# EAGLE design FT-991A_PAT (EAGLE 9.3.0)
COPYRIGHT: PY2RAF; DOCUMENT_ID: PAT-991A; PROJECT_INFO: Yaesu FT-991A Panadapter with Signal Control; PROJECT_NAME: FT-991A PAT & SDR; REVISAO: F; REVISION_ID: F
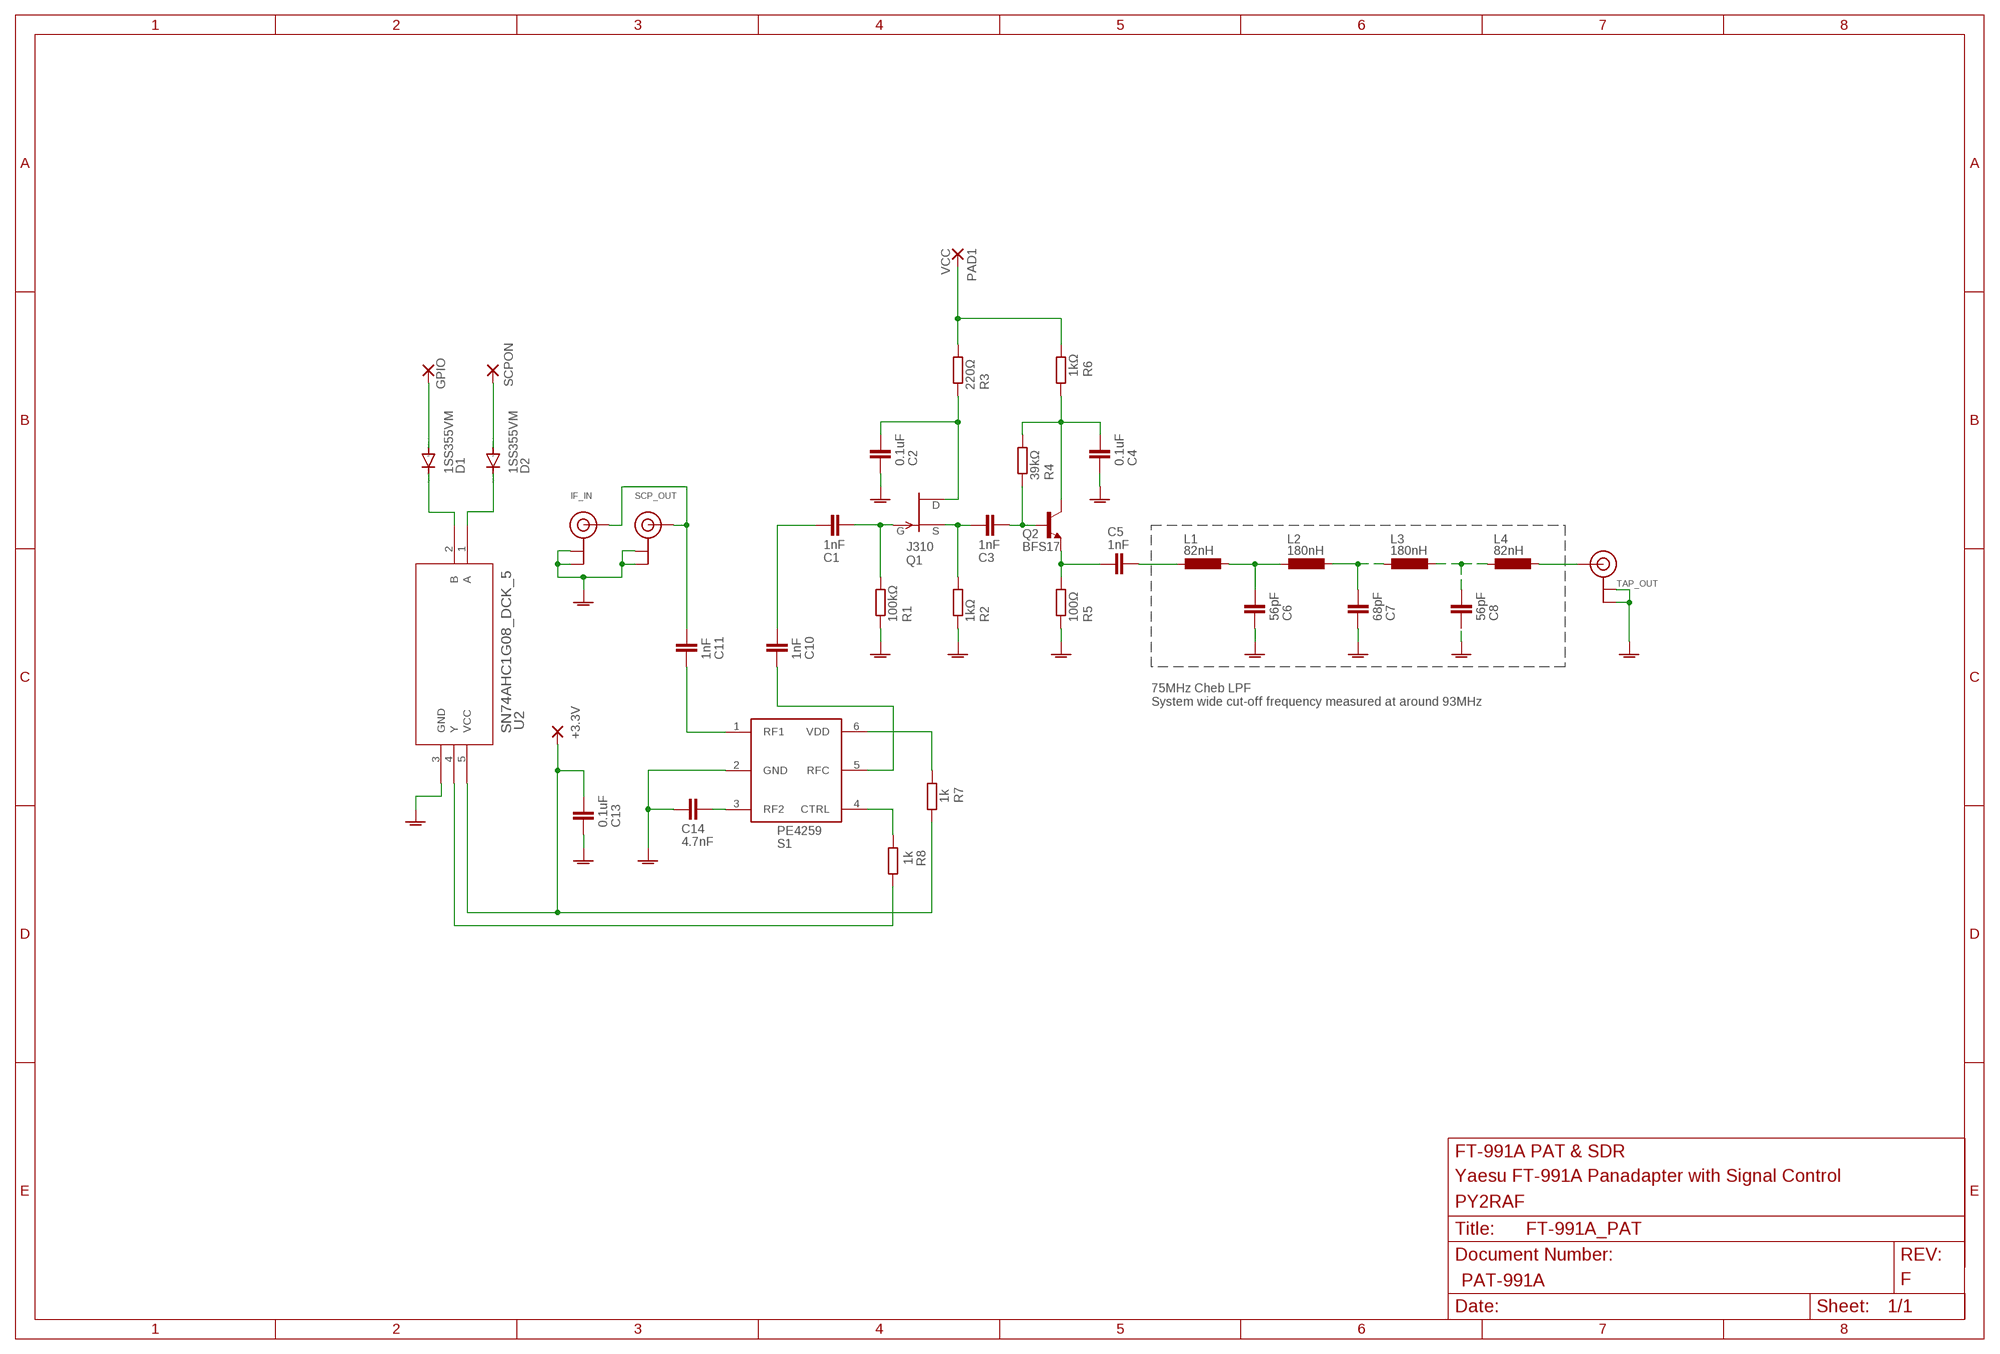
[diagram p0: schematic, sheet 1]

## Parts
+3.3V  WIREPADSMD1,27-254  [SMD1,27-2,54]
C1  1nF  C-EUC0805K  [C0805K]
C2  0.1uF  C-EUC0805K  [C0805K]
C3  1nF  C-EUC0805K  [C0805K]
C4  0.1uF  C-EUC0805K  [C0805K]
C5  1nF  C-EUC0805K  [C0805K]
C6  56pF  C-EUC0805K  [C0805K]
C7  68pF  C-EUC0805K  [C0805K]
C8  56pF  C-EUC0805K  [C0805K]
C10  1nF  C-EUC0805K  [C0805K]
C11  1nF  C-EUC0805K  [C0805K]
C13  0.1uF  C-EUC0805K  [C0805K]
C14  4.7nF  C-EUC0805K  [C0805K]
D1  1SS355VM  DIODE-SOD323-W  [SOD323-W]
D2  1SS355VM  DIODE-SOD323-W  [SOD323-W]
GPIO  GPIO  WIREPADSMD1,27-254  [SMD1,27-2,54]
L1  82nH  L-EU  [L0805]
L2  180nH  L-EU  [L0805]
L3  180nH  L-EU  [L0805]
L4  82nH  L-EU  [L0805]
PAD1  VCC  WIREPADSMD2,54-5,08  [SMD2,54-5,08]
Q1  J310  SST201  [SOT23]
Q2  BFS17  BC846  [SOT23]
R1  100kΩ  R-EU_R0805  [R0805]
R2  1kΩ  R-EU_R0805  [R0805]
R3  220Ω  R-EU_R0805  [R0805]
R4  39kΩ  R-EU_R0805  [R0805]
R5  100Ω  R-EU_R0805  [R0805]
R6  1kΩ  R-EU_R1206  [R1206]
R7  1k  R-EU_R0805  [R0805]
R8  1k  R-EU_R0805  [R0805]
S1  PE4259  [SC-70]
SCPON  SCPON  WIREPADSMD1,27-254  [SMD1,27-2,54]
TAP_OUT  TAP_OUT  ANTENNA_U.FL  [U.FL]
U2  SN74AHC1G08_DCK_5  [DCK5]
X1  SCP_OUT  ANTENNA_U.FL  [U.FL]
X2  IF_IN  ANTENNA_U.FL  [U.FL]

## Nets
GNDA: C2.2 C4.2 C6.2 C7.2 C8.2 C13.2 C14.1 R1.1 R2.1 R5.2 S1.2(GND) TAP_OUT.1(GND) TAP_OUT.2(GND) U2.3(GND) X1.1(GND) X1.2(GND) X2.1(GND) X2.2(GND)
N$1: C5.1 Q2.2(E) R5.1
N$2: C5.2 L1.1
N$3: C6.1 L1.2 L2.1
N$4: C3.2 Q2.1(B) R4.2
N$5: C3.1 Q1.2(S) R2.2
N$6: C1.2 Q1.3(G) R1.2
N$7: C11.1 X1.3(SIGNAL) X2.3(SIGNAL)
N$8: PAD1.1(P) R3.2 R6.1
N$9: C2.1 Q1.1(D) R3.1
N$10: C4.1 Q2.3(C) R4.1 R6.2
N$11: C7.1 L2.2 L3.1
N$12: L4.2 TAP_OUT.3(SIGNAL)
N$13: C8.1 L3.2 L4.1
N$14: C1.1 C10.1
N$15: C10.2 S1.5(RFC)
N$16: D1.A GPIO.1(P)
N$17: D1.C U2.2(B)
N$18: D2.A SCPON.1(P)
N$19: R8.2 S1.4(CTRL)
N$20: D2.C U2.1(A)
N$21: C11.2 S1.1(RF1)
N$22: R8.1 U2.4(Y)
N$24: C14.2 S1.3(RF2)
VCC: +3.3V.1(P) C13.1 R7.1 U2.5(VCC)
VDD: R7.2 S1.6(VDD)

## Notes on the sheet
- 75MHz Cheb LPF
  System wide cut-off frequency measured at around 93MHz

## Library data of the parts
+3.3V GPIO PAD1 SCPON = wirepad:WIREPAD: Wire PAD connect wire on PCB
C1-C8 C10 C11 C13 C14 = rcl:C-EU: CAPACITOR, European symbol
D1 D2 = diode:DIODE-: DIODE
L1-L4 = rcl-modified:L-EU: INDUCTOR, European symbol
Q1 = transistor-fet:?20*: TEMIC / Siliconix N-Channel JFET Source: JFET-J201_Siliconix_data.pdf; SPICEPREFIX: J
Q2 = transistor:BC846: NPN TRANSISTOR
R1-R8 = rcl:R-EU_: RESISTOR, European symbol
S1 = psemi:PE4259: PE4259 SPDT High Power UltraCMOS 10 MHz 3.0 GHz RF Switch Features - High ESD tolerance of 2 kV HBM - Single-pin or complementary CMOS logic control inputs - Low insertion loss: * 0.35 dB @ 1000 MHz * 0.5 dB @ 2000 MHz - Isolation of 30 dB @ 1000 MHz - Typical input 1 dB compression point of +33.5 dBm - 1.8V minimum power supply voltage - Ultra-small SC-70 package
TAP_OUT X1 X2 = adafruit:ANTENNA_U.FL: U.FL Antenna Connector
U2 = sn74ahc1g08-dck:SN74AHC1G08_DCK_5; DATASHEETURL: httpwww.ti.comlitgpnSN74AHC1G08; FAMILY_NAME: LL AND GATE; GENERIC_PART_NUMBER: SN74AHC1G08; INDUSTRY_STD_PKG_TYPE: SC70; MANUFACTURER: Texas Instruments; MANUFACTURER_PART_NUMBER: sn74ahc1g08_dck_5; PACKAGE_DESIGNATOR: DCK; PIN_COUNT: 5; VENDOR: Texas Instruments

## Board
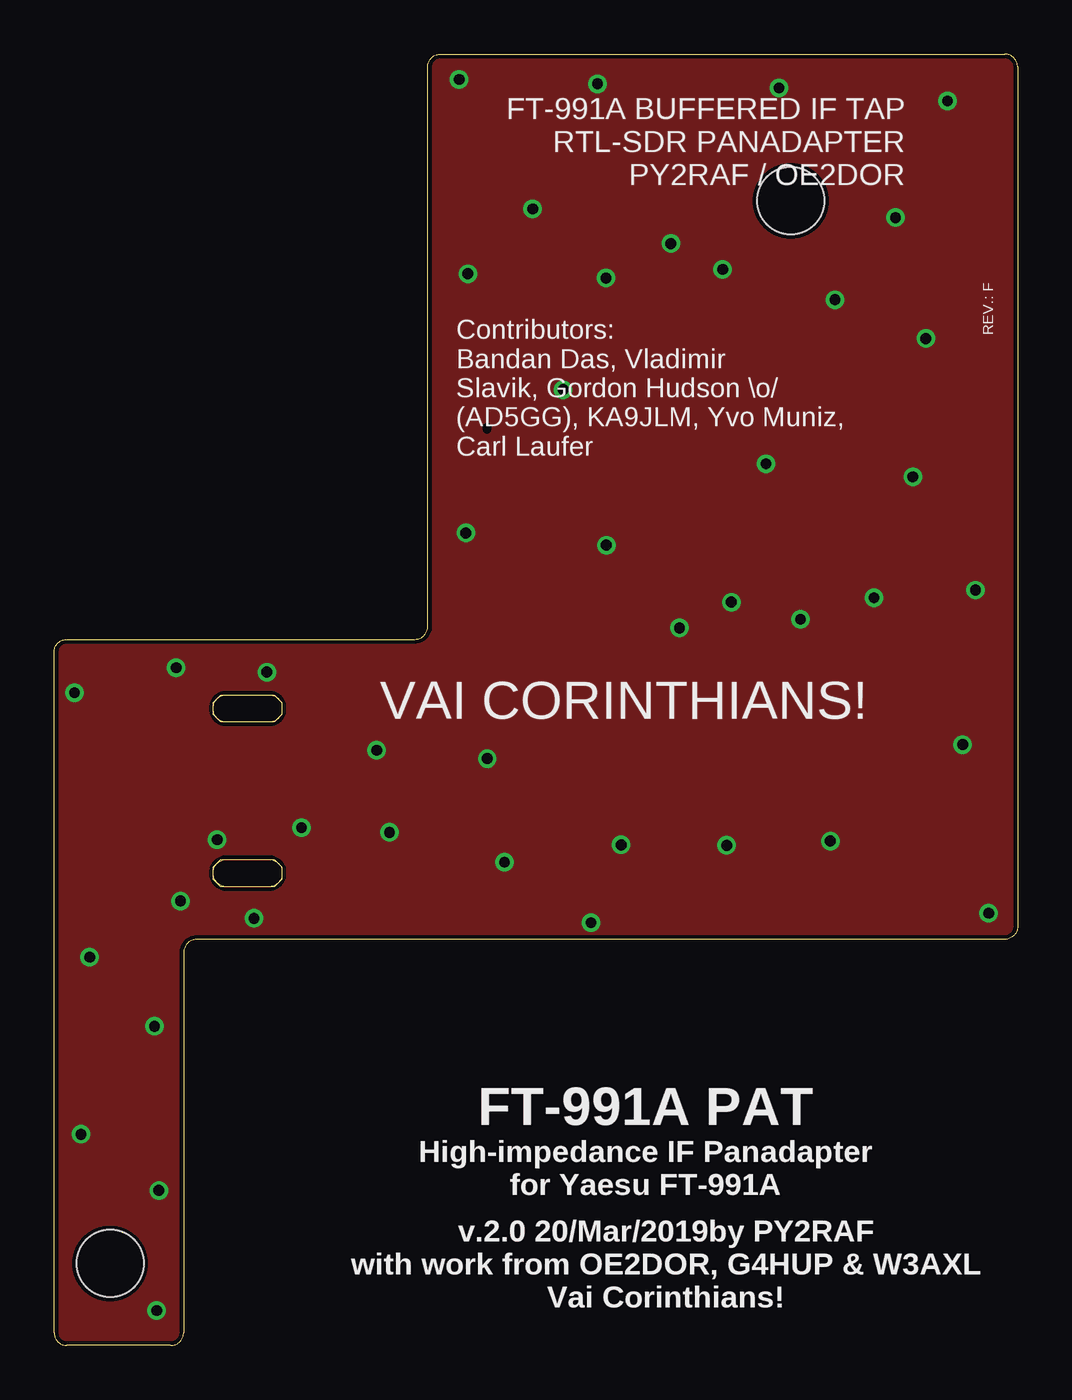
[diagram p1: board, top side]
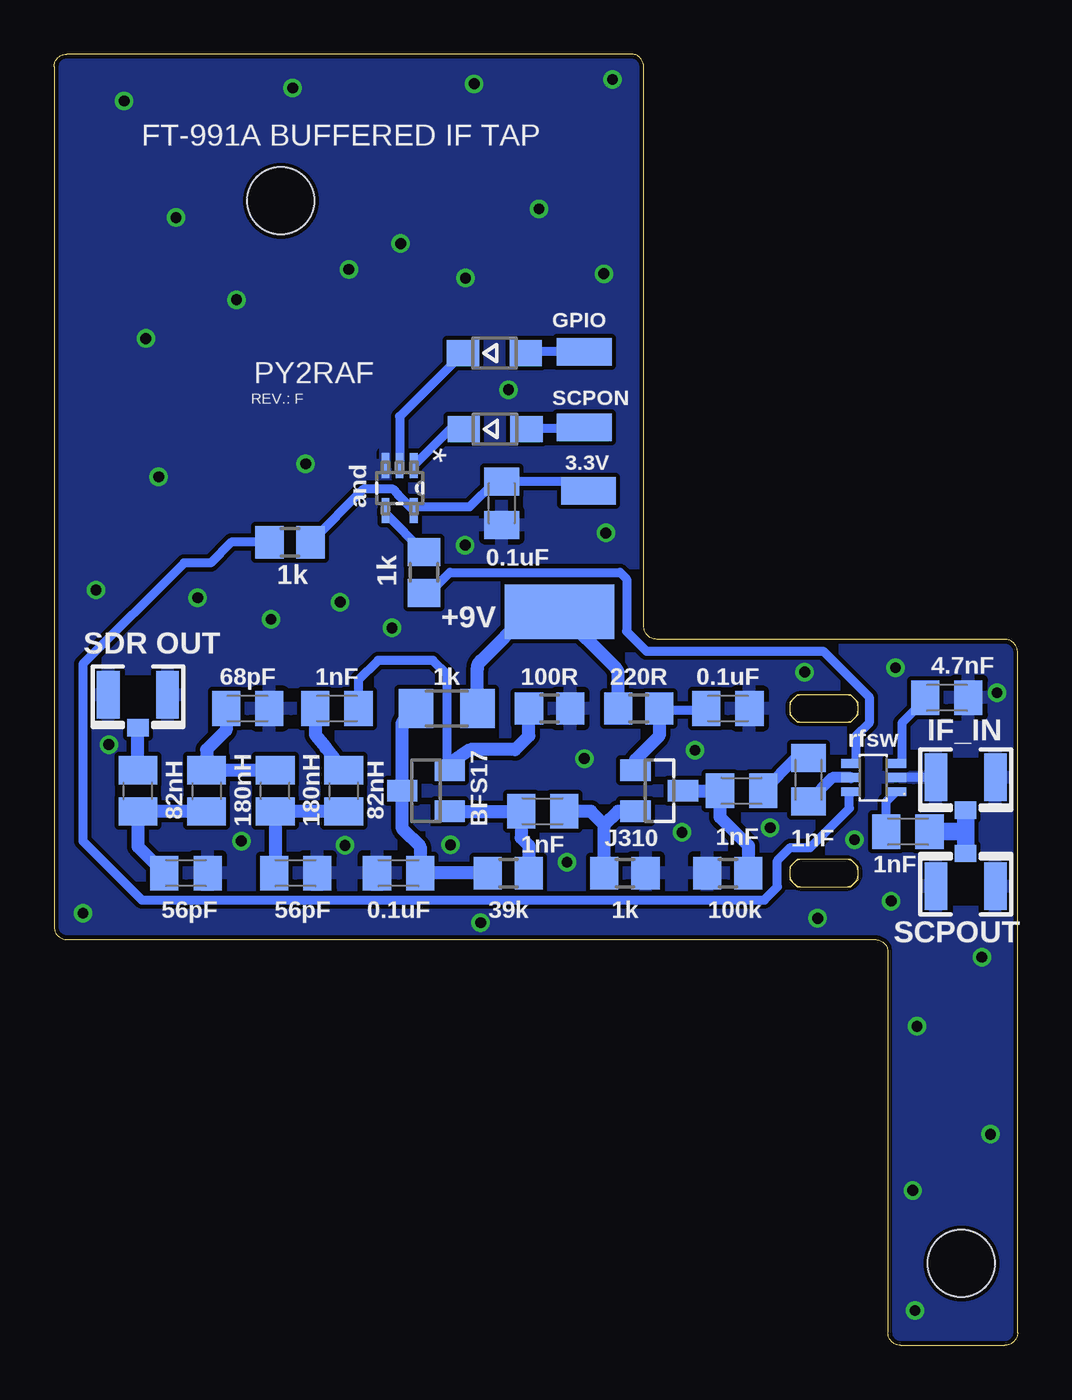
[diagram p2: board, bottom side, seen from below]

Size 44.6 x 59.8 mm. Coordinates in mm from the lower left corner, seen from the top.
Outline: 0,0.6 0,32.1 arc-90 0.6,32.7 16.7,32.7 arc90 17.3,33.3 17.3,59.2 arc-90 17.9,59.8 44,59.8 arc-90 44.6,59.2 44.6,19.4 arc-90 44,18.8 6.6,18.8 arc90 6,18.2 6,0.6 arc-90 5.4,0 0.6,0 arc-90 0,0.6
Outline: 9.95,28.86 7.98,28.86 arc-90 7.38,29.46 7.38,29.53 arc-90 7.98,30.13 9.95,30.13 arc-90 10.55,29.53 10.55,29.46 arc-90 9.95,28.86
Outline: 7.98,22.51 9.95,22.51 arc-90 10.55,21.91 10.55,21.84 arc-90 9.95,21.24 7.98,21.24 arc-90 7.38,21.84 7.38,21.91 arc-90 7.98,22.51
Copper layers (1*16): Top 0.0356mm / dielectric 1.6mm / Bottom 0.0356mm
Design rules "LaenPCBOrder *": minimum track width 16mil, minimum drill 0.5mm, track to track 0.2mm, track to pad 0.2mm, pad to pad 0.2mm, via to via 0.2mm, smd to smd 0.2mm, copper to edge 0.2mm, drill to drill 0.2mm, minimum pad ring 7mil, minimum via ring 7mil, stop-mask expansion 3mil, vias tented up to drill 0mil, thermal gap 10mil
Holes 3.1 mm at 34.1,53 2.6,3.8
Milling: 16 lines

### Footprints (pad centres in the part's own frame; a part is rotated, then mirrored left to right if it is on the bottom)
SMD1,27-2,54 = smd 1.27 x 2.54: 1 0,0
C0805K = smd 1.3 x 1.6: 1 -1,0; 2 1,0
SOD323-W = smd 1.5 x 1.2: A 1.45,0; C -1.45,0
L0805 = smd 1.3 x 1.8: 1 -0.95,0; 2 0.95,0
SMD2,54-5,08 = smd 2.54 x 5.08: 1 0,0
SOT23 = smd 1 x 1.4: 1 -0.95,-1.1; 2 0.95,-1.1; 3 0,1.1
R0805 = smd 1.3 x 1.5: 1 -0.95,0; 2 0.95,0
R1206 = smd 1.6 x 1.803: 1 -1.422,0; 2 1.422,0
SC-70 = smd 0.4 x 0.9: 1 -0.635,-1.035; 2 0.015,-1.035; 3 0.665,-1.035; 4 0.665,1.065; 5 0.015,1.065; 6 -0.635,1.065
U.FL = smd 2.2 x 1.05: 1 0,1.375; 2 0,-1.375 | smd 0.8 x 1: 3 1.525,0
DCK5 = smd 1.168 x 0.356: 1 -1.041,0.65; 2 -1.041,0; 3 -1.041,-0.65; 4 1.041,-0.65; 5 1.041,0.65

### Placement (x,y rotation side)
+3.3V  19.86,39.57 270 bottom
C1  12.78,25.69 180 bottom
C2  13.41,29.49 0 bottom
C3  21.98,24.73 180 bottom
C4  28.65,21.88 180 bottom
C5  31.51,29.49 180 bottom
C6  33.41,21.88 0 bottom
C7  35.64,29.49 0 bottom
C8  38.49,21.88 0 bottom
C10  9.68,26.2 270 bottom
C11  5.08,23.8 180 bottom
C13  23.88,39 270 bottom
C14  3.28,30 180 bottom
D1  24.21,45.95 0 bottom
D2  24.18,42.44 0 bottom
GPIO  20.06,46.01 90 bottom
L1  31.19,25.69 270 bottom
L2  34.37,25.69 90 bottom
L3  37.54,25.69 270 bottom
L4  40.72,25.69 90 bottom
PAD1  21.2,33.97 90 bottom
Q1  16.58,25.69 270 bottom
Q2  27.38,25.69 90 bottom
R1  13.41,21.88 0 bottom
R2  18.17,21.88 180 bottom
R3  17.54,29.49 180 bottom
R4  23.57,21.88 0 bottom
R5  21.67,29.49 0 bottom
R6  26.43,29.49 180 bottom
R7  33.68,37.2 180 bottom
R8  27.48,35.8 270 bottom
S1  6.65,26.28 90 bottom
SCPON  20.06,42.52 270 bottom
TAP_OUT  40.72,30.13 270 bottom
U2  28.6,39.7 270 bottom
X1  2.4,26.31 270 bottom
X2  2.4,21.26 90 bottom

### Tracks (layer width: path | path; a pad name or v marks a point on that pad's centre or on a via)
GNDA  (via drill 0.5)
  Bottom 0.406: X1.2 5.61,26.31 S1.2
  other vias: 34.55,33.62 19.06,37.62 23.57,44.26 15.53,23.76 14.93,27.56 35.93,23.36 43.26,20.02 24.85,19.58 20.85,22.38 11.45,23.98 5.85,20.58 5.65,31.38 1.65,17.98 4.65,14.78 1.25,9.78 4.85,7.18 9.25,19.78 31.13,23.16 42.06,27.82 25.57,37.06 20.05,27.18 9.85,31.18 42.65,34.98 31.35,34.42 19.15,49.62 22.15,52.62 25.55,49.42 28.55,51.02 30.95,49.82 36.15,48.42 38.95,52.22 40.35,46.62 32.95,40.82 39.75,40.22 37.95,34.62 28.95,33.22 4.75,1.62 0.95,30.22 7.55,23.42 26.25,23.18 41.35,57.62 33.55,58.22 25.15,58.42 18.75,58.62
  pour Bottom: -0.56,33.94 14.68,33.94 14.68,61.88 45.16,61.88 45.16,16.16 7.38,16.48 7.06,-1.62 -0.56,-1.62
  pour Top: -0.56,33.94 14.68,33.94 14.68,61.88 45.16,61.88 45.16,16.16 7.06,16.16 7.06,-1.62 -0.56,-1.62
N$1
  Bottom 0.406: 26.28,26.96 Q2.2 26.43,26.78 26.43,31.08 27.06,31.72 29.6,31.72 30.51,30.81 C5.1
  Bottom 0.61: R5.1 22.62,28.22 23.25,27.59 25.32,27.59 26.28,26.96
N$2
  Bottom 0.61: C5.2 32.51,28.27 32.03,27.68 L1.1
N$3
  Bottom 0.61: L1.2 L2.1 34.37,21.92 C6.1
N$4
  Bottom 0.61: Q2.1 25.15,24.74 25.15,24.73 C3.2 22.98,23.51 22.62,23.14 R4.2
N$5
  Bottom 0.61: Q1.2 18.49,24.74 19.12,24.11 | R2.2 19.12,24.11 | 19.12,24.11 19.75,24.73 C3.1
N$6
  Bottom 0.61: Q1.3 C1.2 13.78,24.46 12.46,23.14 R1.2
N$7
  Bottom 0.813: X2.3 2.4,23.8 | 2.4,23.8 X1.3 | 2.4,23.8 C11.1
N$8
  Bottom 0.61: R3.2 18.49,31.06 arc-45 18.63,31.41 PAD1.1 arc45 21.28,33.94 22.62,33.94 24.86,31.7 arc-45 25.01,31.34 R6.1
N$9
  Bottom 0.406: C2.1 14.45,29.42 16.58,29.42 R3.1
  Bottom 0.61: R3.1 16.59,28.22 17.68,27.13 Q1.1
N$10
  Bottom 0.61: R4.1 C4.1 27.65,23.1 28.48,23.93 Q2.3 28.48,28.86 R6.2
N$11
  Bottom 0.61: L2.2 L3.1 37.54,27.59 36.64,28.49 C7.1
N$12
  Bottom 0.61: L4.2 TAP_OUT.3
N$13
  Bottom 0.61: L3.2 L4.1 40.72,23.1 C8.1
N$14
  Bottom 0.508: C10.1 10.26,27.2 C1.1
N$15
  Bottom 0.508: S1.5 8.57,26.3 C10.2
N$16
  Bottom 0.406: GPIO.1 22.71,46.01 D1.A
N$17
  Bottom 0.406: D1.C 28.6,43.01 U2.2
N$18
  Bottom 0.406: D2.A 22.64,42.46 20.22,42.46 SCPON.1
N$19
  Bottom 0.406: S1.4 7.48,27 7.48,28.21 6.87,28.82 6.87,30.03 9,32.15 17.18,32.15 18.09,33.06 18.09,35.49 18.4,35.79 26.28,35.79 27.19,34.88 R8.2
N$20
  Bottom 0.406: U2.1 26.26,42.44 D2.C
N$21
  Bottom 0.406: C11.2 6.08,25.19 S1.1
N$22
  Bottom 0.406: R8.1 29.25,38.52 U2.4
N$24
  Bottom 0.406: S1.3 5.36,27 5.36,28.82 4.45,29.73 C14.2
VCC
  Bottom 0.406: +3.3V.1 20.29,40 C13.1 24.16,40.04 25.37,38.82 27.78,38.82 U2.5 28.67,39.38 28.67,39.41 28.91,39.65 30.28,39.65 R7.1
VDD
  Bottom 0.406: S1.6 7.78,25.48 7.78,24.88 9.6,23.06 10.51,23.06 11.12,22.45 11.12,21.24 11.73,20.63 40.53,20.63 43.26,23.36 43.26,31.55 38.57,36.23 37.36,36.23 36.39,37.2 R7.2

### Text on the board
tPlace: FT-991A BUFFERED IF TAP / RTL-SDR PANADAPTER / PY2RAF / OE2DOR | REV.: F | Contributors: / Bandan Das, Vladimir / Slavik, Gordon Hudson \\o/ / (AD5GG), KA9JLM, Yvo Muniz, / Carl Laufer | VAI CORINTHIANS! | FT-991A PAT | High-impedance IF Panadapter / for Yaesu FT-991A | v.2.0 20/Mar/2019by PY2RAF / with work from OE2DOR, G4HUP & W3AXL / Vai Corinthians!
bPlace: FT-991A BUFFERED IF TAP | GPIO | PY2RAF | SCPON | REV.: F | 3.3V | and | +9V | 0.1uF | 220R | 100R | 1k | 1nF | 68pF | SDR OUT | rfsw | IF_IN | BFS17 | 82nH | 180nH | 180nH | 82nH | 1nF | J310 | 1nF | 100k | 1k | 39k | 0.1uF | 56pF | 56pF | SCPOUT